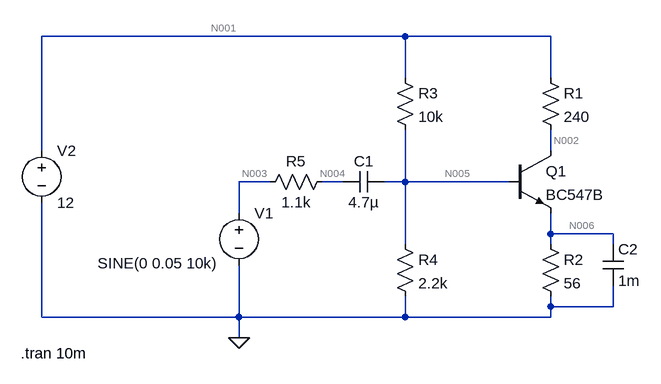
[diagram p0: schematic initial values for componants.asc]
initial values for componants.asc, the LTspice schematic file:
Version 4
SHEET 1 880 680
WIRE 240 -64 -320 -64
WIRE 464 -64 240 -64
WIRE 240 0 240 -64
WIRE 464 0 464 -64
WIRE -320 112 -320 -64
WIRE 464 112 464 80
WIRE 32 160 -16 160
WIRE 144 160 112 160
WIRE 240 160 240 80
WIRE 240 160 208 160
WIRE 400 160 240 160
WIRE -16 208 -16 160
WIRE 464 240 464 208
WIRE 560 240 464 240
WIRE 240 256 240 160
WIRE 464 256 464 240
WIRE 560 256 560 240
WIRE 464 352 464 336
WIRE 560 352 560 320
WIRE 560 352 464 352
WIRE -320 368 -320 192
WIRE -16 368 -16 288
WIRE -16 368 -320 368
WIRE 240 368 240 336
WIRE 240 368 -16 368
WIRE 464 368 464 352
WIRE 464 368 240 368
WIRE -16 400 -16 368
FLAG -16 400 0
DATAFLAG 240 144 ""
DATAFLAG 464 96 ""
SYMBOL npn 400 112 R0
SYMATTR InstName Q1
SYMATTR Value BC547B
SYMBOL res 448 -16 R0
SYMATTR InstName R1
SYMATTR Value 240
SYMBOL res 448 240 R0
SYMATTR InstName R2
SYMATTR Value 56
SYMBOL res 224 -16 R0
SYMATTR InstName R3
SYMATTR Value 10k
SYMBOL res 224 240 R0
SYMATTR InstName R4
SYMATTR Value 2.2k
SYMBOL voltage -16 192 R0
WINDOW 3 -218 93 Left 2
WINDOW 123 0 0 Left 0
WINDOW 39 0 0 Left 0
SYMATTR Value SINE(0 0.05 10k)
SYMATTR InstName V1
SYMBOL voltage -320 96 R0
WINDOW 123 0 0 Left 0
WINDOW 39 0 0 Left 0
SYMATTR InstName V2
SYMATTR Value 12
SYMBOL cap 544 256 R0
SYMATTR InstName C2
SYMATTR Value 1m
SYMBOL res 128 144 R90
WINDOW 0 0 56 VBottom 2
WINDOW 3 32 56 VTop 2
SYMATTR InstName R5
SYMATTR Value 1.1k
SYMBOL cap 208 144 R90
WINDOW 0 0 32 VBottom 2
WINDOW 3 32 32 VTop 2
SYMATTR InstName C1
SYMATTR Value 4.7µ
TEXT -352 424 Left 2 !.tran 10m

The netlist it stands for:
* initial values for componants.asc
Q1 N002 N005 N006 0 BC547B
R1 N001 N002 240
R2 N006 0 56
R3 N001 N005 10k
R4 N005 0 2.2k
V1 N003 0 SINE(0 0.05 10k)
V2 N001 0 12
C2 N006 0 1m
R5 N004 N003 1.1k
C1 N005 N004 4.7µ
.model NPN NPN
.model PNP PNP
.lib standard.bjt
.tran 10m
.backanno
.end

* Results of the author's LTspice run, read from the files saved beside the schematic
* Operating Point, zero values left out:
*   V(n002) = 6.551 V
*   V(n005) = 2.009 V
*   V(n006) = 1.276 V
*   V(n001) = 12 V
*   Ic(Q1) = 22.7 mA
*   Ib(Q1) = 86.02 µA
*   Ie(Q1) = -22.79 mA
*   I(R4) = 913.1 µA
*   I(R3) = 999.1 µA
*   I(R2) = 22.79 mA
*   I(R1) = 22.7 mA
*   I(V2) = -23.7 mA
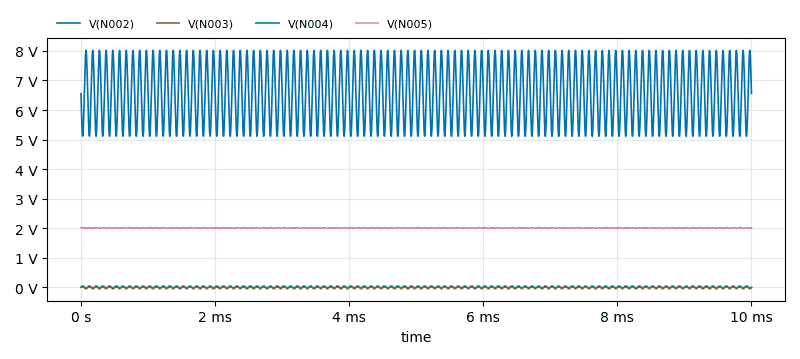
[diagram p1: Transient Analysis of initial values for componants.asc, plotted from the saved traces]
* Transient Analysis, 1 run:
*   V(N002): min 5.111 V, max 8.018 V, average 6.562 V, rms 6.642 V, last 6.561 V
*   V(N003): min -50 mV, max 50 mV, average 221.1 nV, rms 35.93 mV, last 0 V
*   V(N004): min -12.5 mV, max 10.94 mV, average -321.9 µV, rms 8.23 mV, last 62.66 µV
*   V(N005): min 1.996 V, max 2.019 V, average 2.008 V, rms 2.008 V, last 2.008 V